# Altium schematic sheet VOLTAGE SOURCE.SchDoc: VOLTAGE SOURCE
size A3; Author: NGUUYEN QUANG MINH; Organization: My Company; Address1: Address Line 1; Address2: Address Line 2; Address3: Address Line 3; Address4: Address Line 4; SheetNumber: 3; SheetTotal: 5; ProjectTitle: Arduino_DIY_V1.0
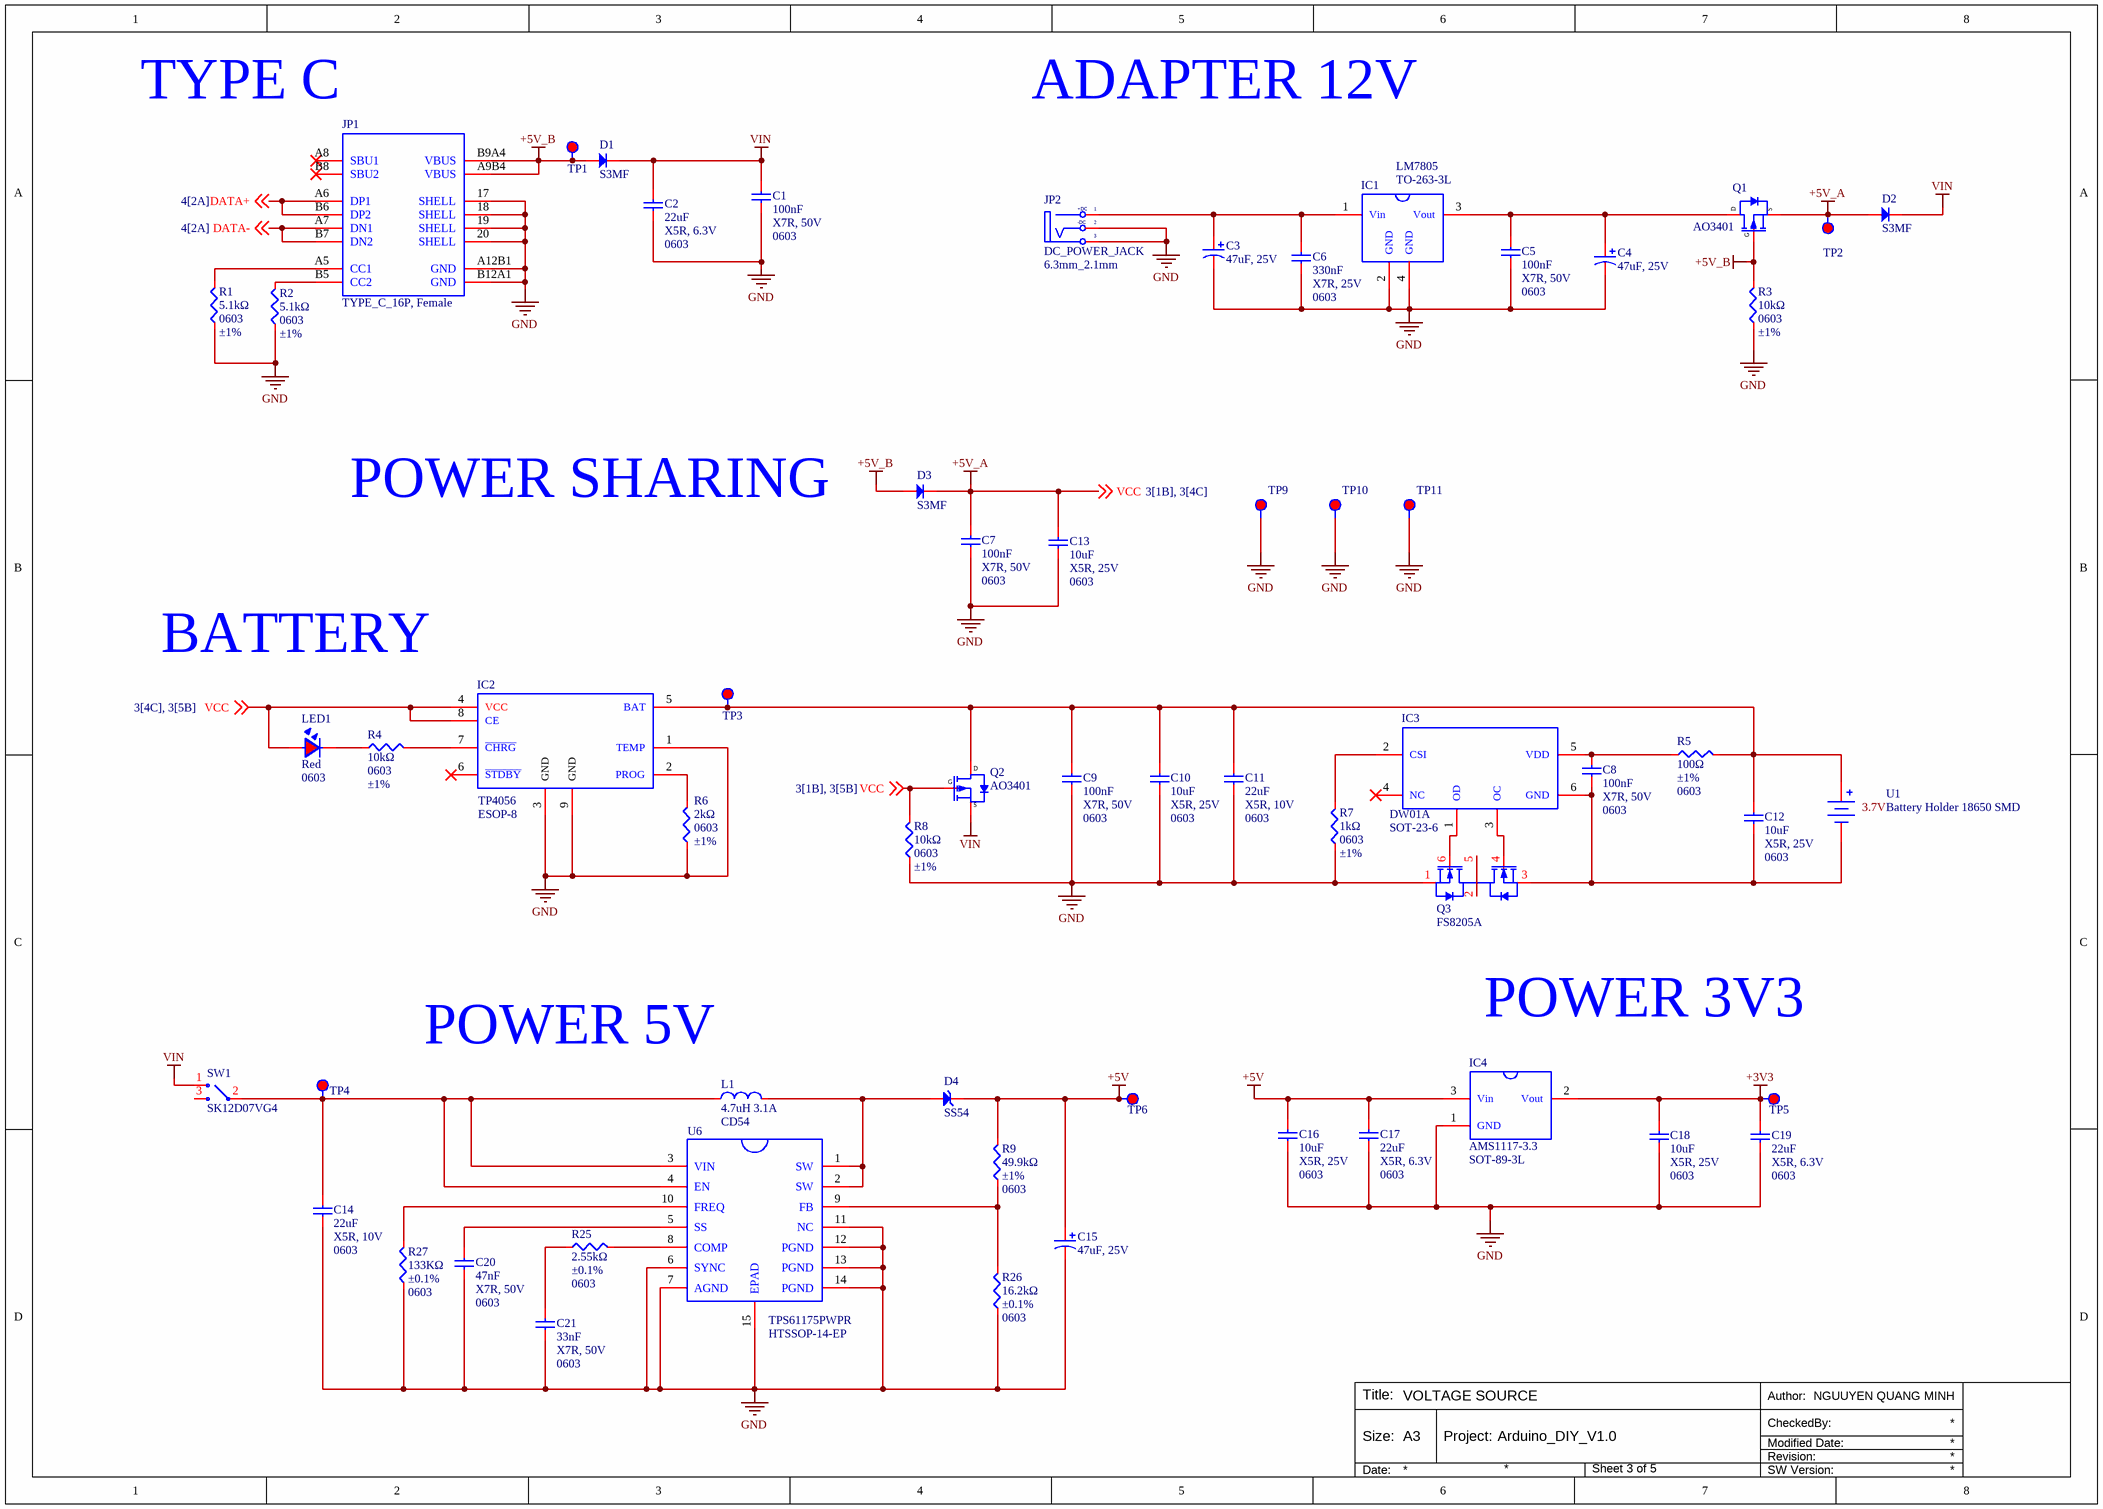
[diagram p0: VOLTAGE SOURCE.SchDoc]

## Parts
C1  100nF  Temperature Coefficient: X7R, 50V  Package: 0603  [C0603]
C2  22uF  Temperature Coefficient: X5R, 6.3V  Package: 0603  [C0603]
C3  47uF, 25V  [CAP_ALU_C]
C4  47uF, 25V  [CAP_ALU_C]
C5  100nF  Temperature Coefficient: X7R, 50V  Package: 0603  [C0603]
C6  330nF  Temperature Coefficient: X7R, 25V  Package: 0603  [C0603]
C7  100nF  Temperature Coefficient: X7R, 50V  Package: 0603  [C0603]
C8  100nF  Temperature Coefficient: X7R, 50V  Package: 0603  [C0603]
C9  100nF  Temperature Coefficient: X7R, 50V  Package: 0603  [C0603]
C10  10uF  Temperature Coefficient: X5R, 25V  Package: 0603  [C0603]
C11  22uF  Temperature Coefficient: X5R, 10V  Package: 0603  [C0603]
C12  10uF  Temperature Coefficient: X5R, 25V  Package: 0603  [C0603]
C13  10uF  Temperature Coefficient: X5R, 25V  Package: 0603  [C0603]
C14  22uF  Temperature Coefficient: X5R, 10V  Package: 0603  [C0603]
C15  47uF, 25V  [CAP_ALU_C]
C16  10uF  Temperature Coefficient: X5R, 25V  Package: 0603  [C0603]
C17  22uF  Temperature Coefficient: X5R, 6.3V  Package: 0603  [C0603]
C18  10uF  Temperature Coefficient: X5R, 25V  Package: 0603  [C0603]
C19  22uF  Temperature Coefficient: X5R, 6.3V  Package: 0603  [C0603]
C20  47nF  Temperature Coefficient: X7R, 50V  Package: 0603  [C0603]
C21  33nF  Temperature Coefficient: X7R, 50V  Package: 0603  [C0603]
D1  S3MF  [D_SMAF_L3.5-W2.6-LS4.7-RD]
D2  S3MF  [D_SMAF_L3.5-W2.6-LS4.7-RD]
D3  S3MF  [D_SMAF_L3.5-W2.6-LS4.7-RD]
D4  SS54  [SMC]
IC1  LM7805  [TO-263-3L]
IC2  TP4056  [ESOP-8]
IC3  DW01A  [SOT-23-6]
IC4  AMS1117-3.3  [SOT-89-3L]
JP1  TYPE_C_16P, Female  [TYPE_C_16P]
JP2  DC_POWER_JACK  Reference: 6.3mm_2.1mm  [DC_POWER_JACK_6.3mm_2.1mm]
L1  4.7uH 3.1A  [CD54]
LED1  Red  Package: 0603  [LED0603_RED]
Q1  AO3401  [TF_SOT_23_3]
Q2  AO3401  [TF_SOT_23_3]
Q3  FS8205A  [TF_SOT23-6]
R1  5.1kΩ  Package: 0603  Tolerance: ±1%  [R0603]
R2  5.1kΩ  Package: 0603  Tolerance: ±1%  [R0603]
R3  10kΩ  Package: 0603  Tolerance: ±1%  [R0603]
R4  10kΩ  Package: 0603  Tolerance: ±1%  [R0603]
R5  100Ω  Tolerance: ±1%  Package: 0603  [R0603]
R6  2kΩ  Package: 0603  Tolerance: ±1%  [R0603]
R7  1kΩ  Package: 0603  Tolerance: ±1%  [R0603]
R8  10kΩ  Package: 0603  Tolerance: ±1%  [R0603]
R9  49.9kΩ  Tolerance: ±1%  Package: 0603  [R0603]
R25  2.55kΩ  Tolerance: ±0.1%  Package: 0603  [R0603]
R26  16.2kΩ  Tolerance: ±0.1%  Package: 0603  [R0603]
R27  133KΩ  Tolerance: ±0.1%  Package: 0603  [R0603]
SW1  SK12D07VG4  [SK12D07VG4]
TP1  Test Point  [TEST_POINT]  (value not drawn)  (no BOM)
TP2  Test Point  [TEST_POINT]  (value not drawn)  (no BOM)
TP3  Test Point  [TEST_POINT]  (value not drawn)  (no BOM)
TP4  Test Point  [TEST_POINT]  (value not drawn)  (no BOM)
TP5  Test Point  [TEST_POINT]  (value not drawn)  (no BOM)
TP6  Test Point  [TEST_POINT]  (value not drawn)  (no BOM)
TP9  Test Point  [TEST_POINT]  (value not drawn)  (no BOM)
TP10  Test Point  [TEST_POINT]  (value not drawn)  (no BOM)
TP11  Test Point  [TEST_POINT]  (value not drawn)  (no BOM)
U1  Battery Holder 18650 SMD  [PIN_18650_1S_HOLDER_SMD]
U6  TPS61175PWPR  [HTSSOP-14-EP]

## Nets
+3V3: C18.2 C19.2 IC4.2(Vout) TP5.1
+5V: C15.1 C16.2 C17.2 D4.1 IC4.3(Vin) R9.2 TP6.1
+5V_A: C7.2 C13.2 D2.2 D3.1 IC2.4(VCC) IC2.8(CE) LED1.1 Q1.2(S) Q2.1(G) R8.2 TP2.1 ; off-sheet VCC  [also labelled VCC]
+5V_B: D1.2 D3.2 JP1.A9B4(VBUS) JP1.B9A4(VBUS) Q1.1(G) R3.2 TP1.1
GND: C1.1 C2.1 C3.2 C4.2 C5.1 C6.1 C7.1 C9.1 C10.1 C11.1 C13.1 C14.1 C15.2 C16.1 C17.1 C18.1 C19.1 C20.1 C21.1 IC1.2(GND) IC1.4(GND) IC2.1(TEMP) IC2.3(GND) IC2.9(GND) IC4.1(GND) JP1.17(SHELL) JP1.18(SHELL) JP1.19(SHELL) JP1.20(SHELL) JP1.A12B1(GND) JP1.B12A1(GND) JP2.2(TN) JP2.3(S) Q3.1(S1) R1.1 R2.1 R3.1 R6.1 R7.1 R8.1 R26.1 R27.1 TP9.1 TP10.1 TP11.1 U6.6(SYNC) U6.7(AGND) U6.11(NC) U6.12(PGND) U6.13(PGND) U6.14(PGND) U6.15(EPAD)
VIN: C1.2 C2.2 D1.1 D2.1 Q2.2(S) SW1.1
DATA+: JP1.A6(DP1) JP1.B6(DP2) ; off-sheet DATA+
DATA-: JP1.A7(DN1) JP1.B7(DN2) ; off-sheet DATA-
NetC3_1: C3.1 C6.2 IC1.1(Vin) JP2.1(T)
NetC4_1: C4.1 C5.2 IC1.3(Vout) Q1.3(D)
NetC8_1: C8.1 C12.1 IC3.6(GND) Q3.3(S2) U1.2
NetC8_2: C8.2 IC3.5(VDD) R5.1
NetC9_2: C9.2 C10.2 C11.2 C12.2 IC2.5(BAT) Q2.3(D) R5.2 TP3.1 U1.1
NetC14_2: C14.2 L1.1 SW1.2 TP4.1 U6.3(VIN) U6.4(EN)
NetC20_2: C20.2 U6.5(SS)
NetC21_2: C21.2 R25.1
NetD4_2: D4.2 L1.2 U6.1(SW) U6.2(SW)
NetIC2_2: IC2.2(PROG) R6.2
NetIC2_7: IC2.7(~{CHRG}) R4.2
NetIC3_1: IC3.1(OD) Q3.6(G1)
NetIC3_2: IC3.2(CSI) R7.2
NetIC3_3: IC3.3(OC) Q3.4(G2)
NetJP1_A5: JP1.A5(CC1) R1.2
NetJP1_B5: JP1.B5(CC2) R2.2
NetLED1_2: LED1.2 R4.1
NetQ3_2: Q3.2(D1/D2) Q3.5(D1/D2)
NetR9_1: R9.1 R26.2 U6.9(FB)
NetR25_2: R25.2 U6.8(COMP)
NetR27_2: R27.2 U6.10(FREQ)

Not connected (* = marked no-connect by the designer): IC2 6(~{STDBY})*; IC3 4(NC)*; JP1 A8(SBU1)* B8(SBU2)*; SW1 3

## Notes on the sheet
- TYPE C
- ADAPTER 12V
- POWER SHARING
- BATTERY
- POWER 5V
- POWER 3V3
- Author:
- Title:
- Size:
- A3
- Project:
- Revision:
- Modified Date:
- CheckedBy:
- Date:
- SW Version:
- (in symbol DC_POWER_JACK_6.3mm_2.1mm) +DC; -DC
- (in symbol PIN_18650_1S_HOLDER_SMD) 3.7V

## Library data of the parts
C1 C5 C7-C9 = C0603_MLCC_100nF_X7R_50V: 50V 100nF X7R ±10% 0603 Multilayer Ceramic Capacitors MLCC - SMD/SMT ROHS; Manufacturer: YAGEO; Mfr. Part: CC0603KRX7R9BB104; LCSC Part: C14663; Capacitance: 100nF; Link: https://www.lcsc.com/product-detail/C14663.html; Tolerance: ±10%; Voltage Rating: 50V
C2 C17 C19 = C0603_MLCC_22uF_X5R_6.3V: 6.3V 22uF X5R ±20% 0603 Multilayer Ceramic Capacitors MLCC - SMD/SMT ROHS; Manufacturer: YAGEO; Mfr. Part: CC0603MRX5R5BB226; LCSC Part: C109448; Capacitance: 22uF; Link: https://www.lcsc.com/product-detail/C109448.html; Voltage Rating: 6.3V; Tolerance: ±20%
C3 C4 C15 = C_ALU_47uF_25V_C: 25V ±20% 47uF SMD,D5xL6.1mm Hybrid Aluminum Electrolytic Capacitors ROHS; Manufacturer: PANASONIC; Mfr. Part: EEHZK1E470R; LCSC Part: C542300; Capacitance: 47uF; Link: https://www.lcsc.com/product-detail/C542300.html; Voltage Rating: 25V; Tolerance: ±20%; Package: C
C6 = C0603_MLCC_330nF_X7R_25V: 25V 330nF X7R ±10% 0603 Multilayer Ceramic Capacitors MLCC - SMD/SMT ROHS; Manufacturer: YAGEO; Mfr. Part: CC0603KRX7R8BB334; LCSC Part: C107070; Capacitance: 330nF; Link: https://www.lcsc.com/product-detail/C107070.html; Voltage Rating: 25V; Tolerance: ±10%
C10 C12 C13 C16 C18 = C0603_MLCC_10uF_X5R_25V: 25V 10uF X5R ±20% 0603 Multilayer Ceramic Capacitors MLCC - SMD/SMT ROHS; Manufacturer: YAGEO; Mfr. Part: CC0603MRX5R8BB106; LCSC Part: C596327; Capacitance: 10uF; Link: https://www.lcsc.com/product-detail/C596327.html; Tolerance: ±20%; Voltage Rating: 25V
C11 C14 = C0603_MLCC_22uF_X5R_10V: 10V 22uF X5R ±20% 0603 Multilayer Ceramic Capacitors MLCC - SMD/SMT ROHS; Manufacturer: Samsung Electro-Mechanics; Mfr. Part: CL10A226MP8NUNE; LCSC Part: C86295; Capacitance: 22uF; Link: https://www.lcsc.com/product-detail/C86295.html; Voltage Rating: 10V; Tolerance: ±20%
C20 = C0603_MLCC_47nF_X7R_50V: 50V 47nF X7R ±10% 0603 Multilayer Ceramic Capacitors MLCC - SMD/SMT ROHS; Manufacturer: YAGEO; Mfr. Part: CC0603KRX7R9BB473; LCSC Part: C107093; Capacitance: 47nF; Link: https://www.lcsc.com/product-detail/C107093.html; Voltage Rating: 50V; Tolerance: ±10%
C21 = C0603_MLCC_33nF_X7R_50V: 50V 33nF X7R ±10% 0603 Multilayer Ceramic Capacitors MLCC - SMD/SMT ROHS; Manufacturer: YAGEO; Mfr. Part: CC0603KRX7R9BB333; LCSC Part: C106856; Capacitance: 33nF; Link: https://www.lcsc.com/product-detail/C106856.html; Tolerance: ±10%; Voltage Rating: 50V
D1-D3 = S3MF: 3A Independent Type 1.1V@3A 1kV SMAF Diodes - General Purpose ROHS; Manufacturer: Shandong Jingdao Microelectronics; Manufacture Part Number: S3MF; Packaging: Cut Tape; Link: https://www.lcsc.com/product-detail/Diodes-General-Purpose_Shandong-Jingdao-Microelectronics-S3MF_C123928.html?s_z=n_s3m; Package: SMAF
D4 = SS54: 40V Independent 550mV@5A 5A SMC Schottky Diodes ROHS; Manufacturer: TWGMC; Manufacture Part Number: SS54; Link: https://www.lcsc.com/product-detail/C5204950.html?s_z=n_B540C-13-F; Package: SMC; Voltage - Forward(Vf@If): 550mV@5A; Category: Schottky Diodes
IC1 = LM7805_TO-263-3L: 62dB@(120Hz) 1A Fixed 4.8V~5.2V Positive 35V TO-263-3L Voltage Regulators - Linear, Low Drop Out (LDO) Regulators ROHS; Manufacturer: HANSCHIP semiconductor; Mfr. Part: LM7805SRG; Number of Outputs: 1; LCSC Part: C5145372; Link: https://www.lcsc.com/product-detail/C5145372.html?s_z=n_lm7805; Category: Power Management (PMIC)/Voltage Regulators - Linear, Low Drop Out (LDO) Regulators; Output Current: 1A; Output Voltage: 4.8V~5.2V; Output Configuration: Positive; Operating Temperature: -40℃~+85℃@(Ta); Voltage - Supply: 35V; Package: TO-263-3L
IC2 = TP4056_ESOP-8: 4V~6V Lithium-ion/Polymer 1 ESOP-8 Battery Management ROHS; Manufacturer: TPOWER; Key Attributes: 1A Lithium Battery Charger; Number of Cells: 1; Charging Saturation Voltage: 4.2V; Mfr. Part: TP4056; LCSC Part: C382139; Voltage - Supply: 4V~6V; Operating Temperature: -40℃~+85℃; Type of Battery: Lithium-ion/Polymer; Link: https://www.lcsc.com/product-detail/C382139.html?s_z=n_tp4056; Package: ESOP-8
IC3 = DW01A: 1.5V~8V Lithium-ion/Polymer 1 SOT-23-6 Battery Management ROHS; Manufacturer: YONGYUTAI; Key Attributes: Lithium battery protection circuit; Number of Cells: 1; Charging Saturation Voltage: 4.3V; Mfr. Part: DW01A; LCSC Part: C2927799; Voltage - Supply: 1.5V~8V; Operating Temperature: -40℃~+85℃; Type of Battery: Lithium-ion/Polymer; Link: https://www.lcsc.com/product-detail/C2927799.html?s_z=n_dw01a; Package: SOT-23-6
IC4 = AMS1117-3.3_SOT-89-3L: 1A Fixed 3.3V Positive 15V SOT-89-3L Voltage Regulators - Linear, Low Drop Out (LDO) Regulators ROHS; Manufacturer: HXY MOSFET; Voltage Dropout: 12mV@(1A); Number of Outputs: 1; Voltage - Supply: 16V; Mfr. Part: AMS1117-3.3; LCSC Part: C5345982; Link: https://www.lcsc.com/product-detail/C5345982.html?s_z=n_ams1117; Category: Power Management (PMIC)/Voltage Regulators - Linear, Low Drop Out (LDO) Regulators; Output Current: 1A; Output Voltage: 3.3V; Output Configuration: Positive; Operating Temperature: 0℃~+125℃@(Ta); Package: SOT-89-3L
JP1 = TYPE_C_16P: 3A USB 3.1 1 Surface Mount, Right Angle 16P Female -40℃~+85℃ Type-C SMD USB Connectors ROHS; Manufacturer: SHOU HAN; Mfr. Part: TYPE-C-3.1-16PIN; Protocol Standard: USB 3.1; LCSC Part: C7507405; Package: SMD; Current Rating-Power: 3A; Mounting Type: Surface Mount, Right Angle; Number of Contacts: 16P; Gender: Female; Operating Temperature: -40℃~+85℃; Link: https://www.lcsc.com/product-detail/C7507405.html?s_z=n_SHOU%2520HAN%2520TYPE-C-3.1-16PIN
JP2 = DC_POWER_JACK_6.3mm_2.1mm: Right Angle DC Power Jack -40℃~+85℃ 2.1mm 6.3mm 3A 500V Through Hole DC Power Connectors ROHS; Manufacturer: Lian Xin Technology; Mfr. Part: XDJK-0051-025; LCSC Part: C7498153; Package: Through Hole; Current Rating-Power: 3A; Link: https://www.lcsc.com/product-detail/C7498153.html?s_z=n_XDJK-0051-025; Connector Type: DC Power Jack; Operating Temperature: -40℃~+85℃; Inside Contact Diameter: 2.1mm; Outside Contact Diameter: 6.3mm; Current Rating: 3A; Voltage Rating (Max): 500V
L1 = CD54_4.7uH_3.1A: 3.1A 4.7uH ±20% SMD,5.8x5.2mm Power Inductors ROHS; Manufacturer: Ceaiya; Manufacture Part Number: CD54-4R7M; Packaging: Cut Tape; Link: https://www.lcsc.com/product-detail/Power-Inductors_Ceaiya-CD54-4R7M_C7588991.html?s_z=n_cd54%204.7uH; Inductor: 4.7uH; Current: 3.1A; Package: CD54
LED1 = LED0603_Red: 20mA 230mcd Water Clear -40℃~+85℃ 630nm Red 120° 75mW 1.95V 0603 LED Indication - Discrete ROHS; Manufacturer: Kingbright; Mfr. Part: APT1608SURCK; Key Attributes: 1.6 x 0.8 mm SMD Chip LED Lamp; LCSC Part: C5875723; Illumination Color: Red; Power(Watts): 75mW; Voltage - Forward(Vf): 1.95V; Forward Current: 20mA; Operating Temperature: -40℃~+85℃; Link: https://www.lcsc.com/product-detail/C5875723.html
Q1 Q2 = AO3401: 30V 4.2A 42mΩ@10V,4A 1.4W 800mV@250uA 1 Piece P-Channel SOT-23 MOSFETs ROHS; Manufacturer: ElecSuper; Manufacture Part Number: AO3401; Packaging: Cut Tape (CT); Link: https://www.lcsc.com/product-detail/MOSFETs_ElecSuper-AO3401_C5224195.html; Drain Source Voltage (Vdss): 30V; Continuous Drain Current (Id): 4.2A; Power Dissipation (Pd): 1.4W; Package: SOT-23-3
Q3 = FS8205A: 20V 25mΩ@2.5V,3A 1.5W 500mV SOT-23-6 MOSFETs ROHS; Manufacturer: TECH PUBLIC; Manufacture Part Number: FS8205A; Packaging: Cut Tape (CT); Link: https://www.lcsc.com/product-detail/MOSFETs_TECH-PUBLIC-FS8205A_C2830320.html?s_z=n_fs8205; Drain to Source Voltage: 20V; RDS(on): 25mΩ@2.5V,3A; Gate Threshold Voltage (Vgs(th)@Id): 500mV; Package: SOT-23-6
R1 R2 = R0603_5.1kΩ_±1%: 100mW Thick Film Resistor 75V ±100ppm/℃ ±1% 5.1kΩ 0603 Chip Resistor - Surface Mount ROHS; Manufacturer: YAGEO; Mfr. Part: RC0603FR-075K1L; LCSC Part: C105580; Resistance: 5.1kΩ; Operating Temperature: -55℃~+155℃; Link: https://www.lcsc.com/product-detail/C105580.html; Power(Watts): 100mW
R3 R4 R8 = R0603_10kΩ_±1%: 100mW Thick Film Resistor 75V ±100ppm/℃ ±1% 10kΩ 0603 Chip Resistor - Surface Mount ROHS; Manufacturer: YAGEO; Mfr. Part: RC0603FR-0710KL; LCSC Part: C98220; Resistance: 10kΩ; Operating Temperature: -55℃~+155℃; Link: https://www.lcsc.com/product-detail/C98220.html
R5 = R0603_100Ω_±1%: 100mW Thick Film Resistor 75V ±100ppm/℃ ±1% 100Ω 0603 Chip Resistor - Surface Mount ROHS; Manufacturer: YAGEO; Mfr. Part: RC0603FR-13100RL; LCSC Part: C845629; Resistance: 100Ω; Operating Temperature: -55℃~+155℃; Link: https://www.lcsc.com/product-detail/C845629.html
R6 = R0603_2kΩ_±1%: 100mW Thick Film Resistor 75V ±100ppm/℃ ±1% 2kΩ 0603 Chip Resistor - Surface Mount ROHS; Manufacturer: YAGEO; Mfr. Part: RC0603FR-072KL; LCSC Part: C105576; Resistance: 2kΩ; Operating Temperature: -55℃~+155℃; Link: https://www.lcsc.com/product-detail/C105576.html
R7 = R0603_1kΩ_±1%: 100mW Thick Film Resistor 75V ±100ppm/℃ ±1% 1kΩ 0603 Chip Resistor - Surface Mount ROHS; Manufacturer: YAGEO; Mfr. Part: RC0603FR-071KL; LCSC Part: C22548; Resistance: 1kΩ; Operating Temperature: -55℃~+155℃; Link: https://www.lcsc.com/product-detail/C22548.html
R9 = R0603_49.9KΩ_±1%: 100mW Thick Film Resistor 75V ±100ppm/℃ ±1% 49.9kΩ 0603 Chip Resistor - Surface Mount ROHS; Manufacturer: YAGEO; Mfr. Part: RC0603FR-0749K9L; LCSC Part: C114624; Resistance: 49.9kΩ; Operating Temperature: -55℃~+155℃; Link: https://www.lcsc.com/product-detail/C114624.html?s_z=n_C114624
R25 = R0603_2.55KΩ_±0.1%: 100mW Thin Film Resistor 75V ±25ppm/℃ ±0.1% 2.55kΩ 0603 Chip Resistor - Surface Mount ROHS; Manufacturer: YAGEO; Mfr. Part: RT0603BRD072K55L; LCSC Part: C326728; Resistance: 2.55kΩ; Operating Temperature: -55℃~+155℃; Link: https://www.lcsc.com/product-detail/C326728.html
R26 = R0603_16.2KΩ_±0.1%: 100mW Thin Film Resistor 75V ±50ppm/℃ ±0.1% 16.2kΩ 0603 Chip Resistor - Surface Mount ROHS; Manufacturer: YAGEO; Mfr. Part: RT0603BRE0716K2L; LCSC Part: C728602; Resistance: 16.2kΩ; Operating Temperature: -55℃~+155℃; Link: https://www.lcsc.com/product-detail/C728602.html
R27 = R0603_133KΩ_±0.1%: 100mW Thin Film Resistor 75V ±50ppm/℃ ±0.1% 133kΩ 0603 Chip Resistor - Surface Mount ROHS; Manufacturer: YAGEO; Mfr. Part: RT0603BRE07133KL; LCSC Part: C861659; Resistance: 133KΩ; Operating Temperature: -55℃~+155℃; Link: https://www.lcsc.com/product-detail/C861659.html
SW1 = SK12D07VG4: 500mA SPDT 50V 5千次 Plugin Slide Switches ROHS; Manufacturer: SHOU HAN; Manufacture Part Number: SK12D07VG4; Link: https://www.lcsc.com/product-detail/Slide-Switches_SHOU-HAN-SK12D07VG4_C393937.html; Package: Plugin
TP1-TP6 TP9-TP11 = TEST_POINT
U1 = PIN_18650_1S_HOLDER_SMD: Battery Holder -10℃~+100℃ Gold Phosphor Bronze Button And Strip Battery Connector ROHS; Manufacturer: MYOUNG; Mfr. Part: BH-18650-B5BA008; Battery Type: 18650; LCSC Part: C5371777; Package: ---; Connector Type: Battery Holder; Link: https://www.lcsc.com/product-detail/C5371777.html?s_z=h_BATTERRY%252018650%2520HOLER
U6 = TPS61175PWPR: Boost Adjustable 2.9V~38V 2.9V~18V 3A HTSSOP-14-EP DC-DC Converters ROHS; Manufacturer: TI; Frequency - Switching: 2.2MHz; Number of Outputs: 1; Package: HTSSOP-14-EP; Mfr. Part: TPS61175PWPR; LCSC Part: C43276; Voltage - Supply: 2.9V~18V; Link: https://www.lcsc.com/product-detail/C43276.html?s_z=n_TPS61175; Function: Boost; Output Current: 3A